# Altium schematic sheet principal_output.SchDoc
size 420 x 297 mm
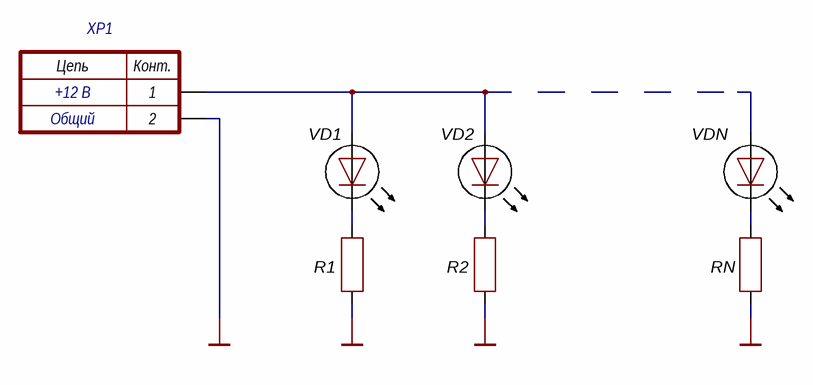
[diagram p0: principal_output.SchDoc]

## Parts
R1  R  [R_1206]  (value not drawn)
R2  R  [R_1206]  (value not drawn)
RN  R  [R_1206]  (value not drawn)
VD1  LED  (value not drawn)
VD2  LED  (value not drawn)
VDN  LED  (value not drawn)
XP1  X_2  (value not drawn)

## Nets
GND: R1.1 R2.1 RN.1 XP1.2
NetR1_2: R1.2 VD1.2(C)
NetR2_2: R2.2 VD2.2(C)
NetRN_2: RN.2 VDN.2(C)
NetVD1_1: VD1.1(A) VD2.1(A) XP1.1

Not connected (* = marked no-connect by the designer): VDN 1(A)

## Notes on the sheet
- Общий
- +12 В
- Перв. примен.
- Справ. №
- Подп. и дата
- Инв. № дубл.
- Взам. инв. №
- Разраб.
- Изм.
- Лист
- № докум.
- Подп.
- Дата
- Лит.
- Масса
- Масштаб
- Пров.
- Т. контр.
- Листов
- Инв. № подл.
- Н. контр.
- Утв.
- Копировал
- Формат А3
- (in symbol X_2) Цепь; Конт.